# Altium project H-briddge-MIA.PrjPcb
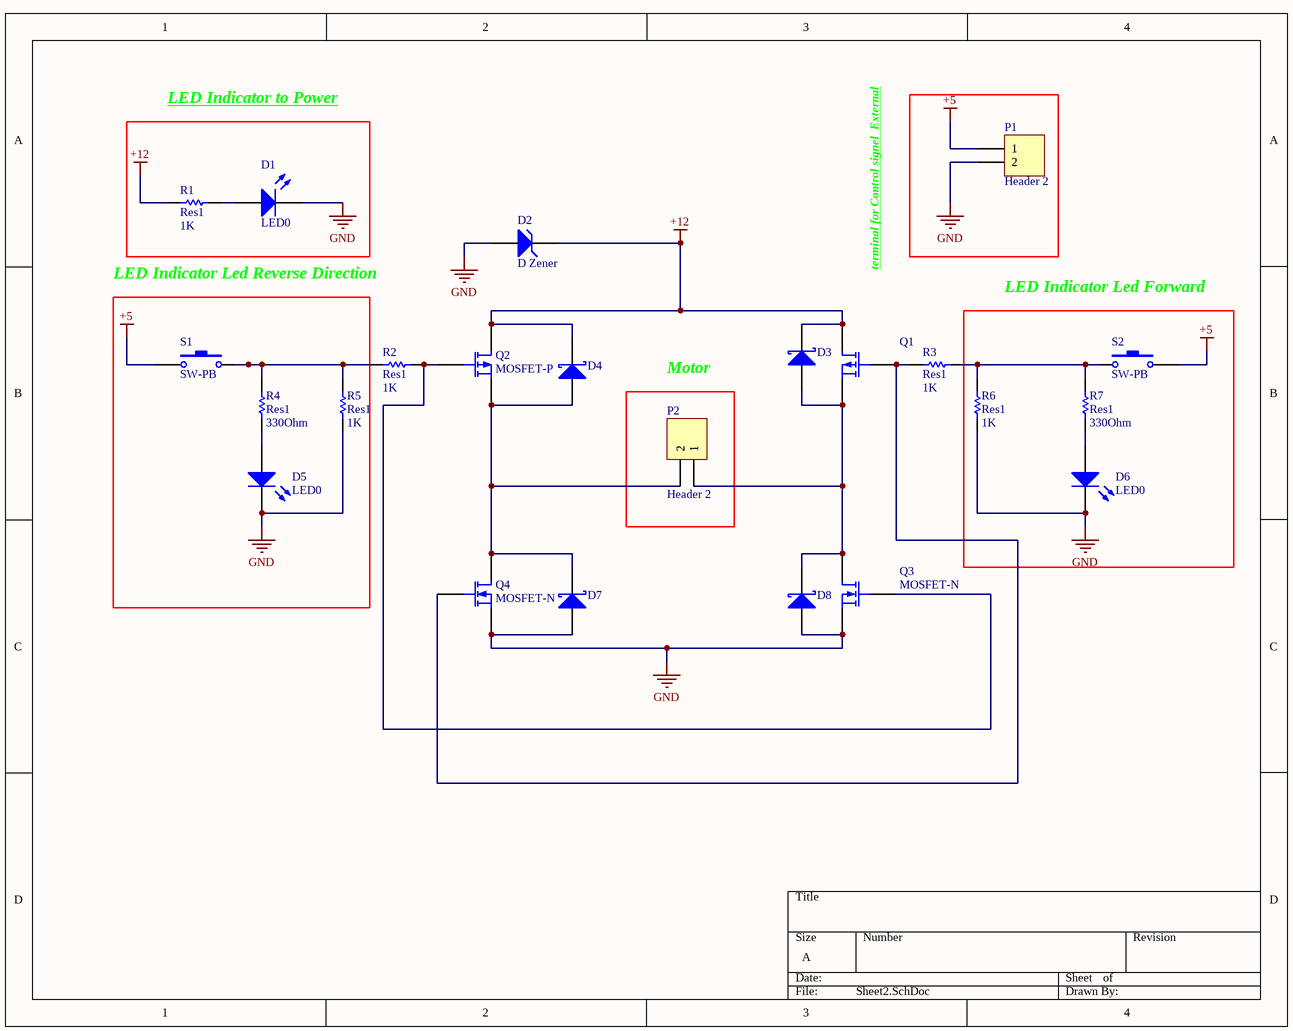
[diagram p0: Sheet2.SchDoc]
1 sheet, 23 parts. Net scope: global (net labels, ports and power ports of the same name join across sheets).
Board file: PCB1.PcbDoc

## Sheet Sheet2.SchDoc
size A; SheetNumber: 1; SheetTotal: 1

### Parts
D1  LED0  [LED-0]
D2  D Zener  [DIODE-0.7]
D3  Diode 10TQ045  [TO-220AC]  (value not drawn)
D4  Diode 10TQ045  [TO-220AC]  (value not drawn)
D5  LED0  [LED-0]
D6  LED0  [LED-0]
D7  Diode 10TQ045  [TO-220AC]  (value not drawn)
D8  Diode 10TQ045  [TO-220AC]  (value not drawn)
P1  Header 2  [HDR1X2]
P2  Header 2  [HDR1X2]
Q1  MOSFET-P  [E3]  (value not drawn)
Q2  MOSFET-P  [E3]
Q3  MOSFET-N  [E3]
Q4  MOSFET-N  [E3]
R1  Res1  value 1K  [AXIAL-0.3]
R2  Res1  value 1K  [AXIAL-0.3]
R3  Res1  value 1K  [AXIAL-0.3]
R4  Res1  value 330Ohm  [AXIAL-0.3]
R5  Res1  value 1K  [AXIAL-0.3]
R6  Res1  value 1K  [AXIAL-0.3]
R7  Res1  value 330Ohm  [AXIAL-0.3]
S1  SW-PB  [SPST-2]
S2  SW-PB  [SPST-2]

### Blocks framed on the sheet
LED Indicator to Power: D1 R1
LED Indicator Led Reverse Direction: D5 R4 R5 S1
LED Indicator Led Forward: D6 R6 R7 S2
Motor: P2

### Nets
+5: P1.1 S1.1 S2.2
+12: D2.2(K) D3.1(K) D4.1(K) Q1.1(D) Q2.1(D) R1.1
GND: D1.2(K) D2.1(A) D5.2(K) D6.2(K) D7.3(A) D8.3(A) P1.2 Q3.3(S) Q4.3(S) R5.1 R6.1
NetD1_1: D1.1(A) R1.2
NetD3_3: D3.3(A) D8.1(K) P2.1 Q1.3(S) Q3.1(D)
NetD4_3: D4.3(A) D7.1(K) P2.2 Q2.3(S) Q4.1(D)
NetD5_1: D5.1(A) R4.1
NetD6_1: D6.1(A) R7.2
NetQ1_2: Q1.2(G) Q4.2(G) R3.1
NetQ2_2: Q2.2(G) Q3.2(G) R2.2
NetR2_1: R2.1 R4.2 R5.2 S1.2
NetR3_2: R3.2 R6.2 R7.1 S2.1

### Notes on the sheet
- terminal for Control signel  External

### Library data of the parts
D1 D5 D6 = LED0: Typical INFRARED GaAs LED; Published: 8-Jun-2000; LatestRevisionDate: 08-Jul-2005; LatestRevisionNote: Mech Layer 1 removed.; PackageReference: LED-0; Publisher: Altium Limited; PackageDescription: LED; 2 Leads
D2 = D Zener: Zener Diode; Published: 8-Jun-2000; LatestRevisionDate: 17-Jul-2002; LatestRevisionNote: Re-released for DXP Platform.; PackageReference: DIODE-0.7; Publisher: Altium Limited; PackageDescription: Diode, Thru-Hole; 2 Leads; 0.7 in Pin Spacing
D3 D4 D7 D8 = Diode 10TQ045: Schottky Rectifier; Note: Terminal 2 is the TAB and is electrically connected to the cathode; Published: 8-Jun-2000; LatestRevisionDate: 17-Jul-2002; LatestRevisionNote: Re-released for DXP Platform.; DatasheetVersion: PD-2.057B; PackageVersion: Feb-1998; PackageReference: TO-220AC; Publisher: Altium Limited; PackageDescription: TO, Thru-Hole, Vertical, Heatsink Mounted; 3 In-Line Leads (1 Absent); Pitch 2.54 mm; ComponentLink1Description: Manufacturer Link; ComponentLink1URL: http://www.irf.com/; ComponentLink2Description: Datasheet; ComponentLink2URL: http://www.irf.com/product-info/datasheets/data/10tq.pdf
P1 P2 = Header 2: Header, 2-Pin; LatestRevisionDate: 17-Jul-2002; LatestRevisionNote: Re-released for DXP Platform.; Publisher: Altium Limited
Q1 Q2 = MOSFET-P: P-Channel MOSFET; Published: 8-Jun-2000; LatestRevisionDate: 17-Jul-2002; LatestRevisionNote: Re-released for DXP Platform.; PackageVersion: 1995/1996; PackageReference: E3; Publisher: Altium Limited; PackageDescription: TO, Flat Index; 3 In-Line, Axial Leads; Body Dia. 4.6mm; Lead Dia. 0.5 mm (max)
Q3 Q4 = MOSFET-N: N-Channel MOSFET; Published: 8-Jun-2000; LatestRevisionDate: 17-Jul-2002; LatestRevisionNote: Re-released for DXP Platform.; PackageVersion: 1995/1996; PackageReference: E3; Publisher: Altium Limited; PackageDescription: TO, Flat Index; 3 In-Line, Axial Leads; Body Dia. 4.6mm; Lead Dia. 0.5 mm (max)
R1-R7 = Res1: Resistor; Published: 8-Jun-2000; LatestRevisionDate: 17-Jul-2002; LatestRevisionNote: Re-released for DXP Platform.; PackageReference: AXIAL-0.3; Publisher: Altium Limited; PackageDescription: Axial Device, Thru-Hole; 2 Leads; 0.3 in Pin Spacing
S1 S2 = SW-PB: Switch; Published: 24-Mar-1999; LatestRevisionDate: 17-Jul-2002; LatestRevisionNote: Re-released for DXP Platform.; PackageReference: SPST-2; Publisher: Altium Limited; PackageDescription: Switch; 2 Leads